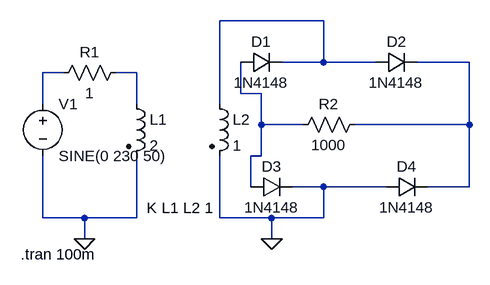
[diagram p0: schematic Bridge rectifier without filter.asc]
Bridge rectifier without filter.asc, the LTspice schematic file:
Version 4
SHEET 1 880 680
WIRE 400 -16 240 -16
WIRE 400 48 400 -16
WIRE 400 48 336 48
WIRE 480 48 400 48
WIRE 624 48 544 48
WIRE 0 64 -32 64
WIRE 112 64 80 64
WIRE 272 96 272 48
WIRE 304 96 272 96
WIRE -32 112 -32 64
WIRE 112 112 112 64
WIRE 240 112 240 -16
WIRE 304 144 304 96
WIRE 368 144 304 144
WIRE 624 144 624 48
WIRE 624 144 448 144
WIRE 304 192 304 144
WIRE 304 192 288 192
WIRE 288 240 288 192
WIRE 400 240 352 240
WIRE 496 240 400 240
WIRE 624 240 624 144
WIRE 624 240 560 240
WIRE -32 288 -32 192
WIRE 32 288 -32 288
WIRE 112 288 112 192
WIRE 112 288 32 288
WIRE 240 288 240 192
WIRE 320 288 240 288
WIRE 400 288 400 240
WIRE 400 288 320 288
WIRE 32 320 32 288
WIRE 320 320 320 288
FLAG 32 320 0
FLAG 320 320 0
SYMBOL voltage -32 96 R0
WINDOW 123 0 0 Left 0
WINDOW 39 0 0 Left 0
SYMATTR InstName V1
SYMATTR Value SINE(0 230 50)
SYMBOL ind2 96 96 R0
SYMATTR InstName L1
SYMATTR Value 2
SYMATTR Type ind
SYMBOL ind2 224 96 R0
SYMATTR InstName L2
SYMATTR Value 1
SYMATTR Type ind
SYMBOL res 96 48 R90
WINDOW 0 0 56 VBottom 2
WINDOW 3 32 56 VTop 2
SYMATTR InstName R1
SYMATTR Value 1
SYMBOL res 464 128 R90
WINDOW 0 0 56 VBottom 2
WINDOW 3 32 56 VTop 2
SYMATTR InstName R2
SYMATTR Value 1000
SYMBOL diode 272 64 R270
WINDOW 0 32 32 VTop 2
WINDOW 3 0 32 VBottom 2
SYMATTR InstName D1
SYMATTR Value 1N4148
SYMBOL diode 480 64 R270
WINDOW 0 32 32 VTop 2
WINDOW 3 0 32 VBottom 2
SYMATTR InstName D2
SYMATTR Value 1N4148
SYMBOL diode 288 256 R270
WINDOW 0 32 32 VTop 2
WINDOW 3 0 32 VBottom 2
SYMATTR InstName D3
SYMATTR Value 1N4148
SYMBOL diode 496 256 R270
WINDOW 0 32 32 VTop 2
WINDOW 3 0 32 VBottom 2
SYMATTR InstName D4
SYMATTR Value 1N4148
TEXT 128 272 Left 2 !K L1 L2 1
TEXT -66 344 Left 2 !.tran 100m

The netlist it stands for:
* Bridge rectifier without filter.asc
V1 N003 0 SINE(0 230 50)
L1 N004 0 2
L2 N001 0 1
R1 N004 N003 1
R2 N002 N005 1000
D1 N005 N001 1N4148
D2 N001 N002 1N4148
D3 N005 0 1N4148
D4 0 N002 1N4148
.model D D
.lib standard.dio
K L1 L2 1
.tran 100m
.backanno
.end